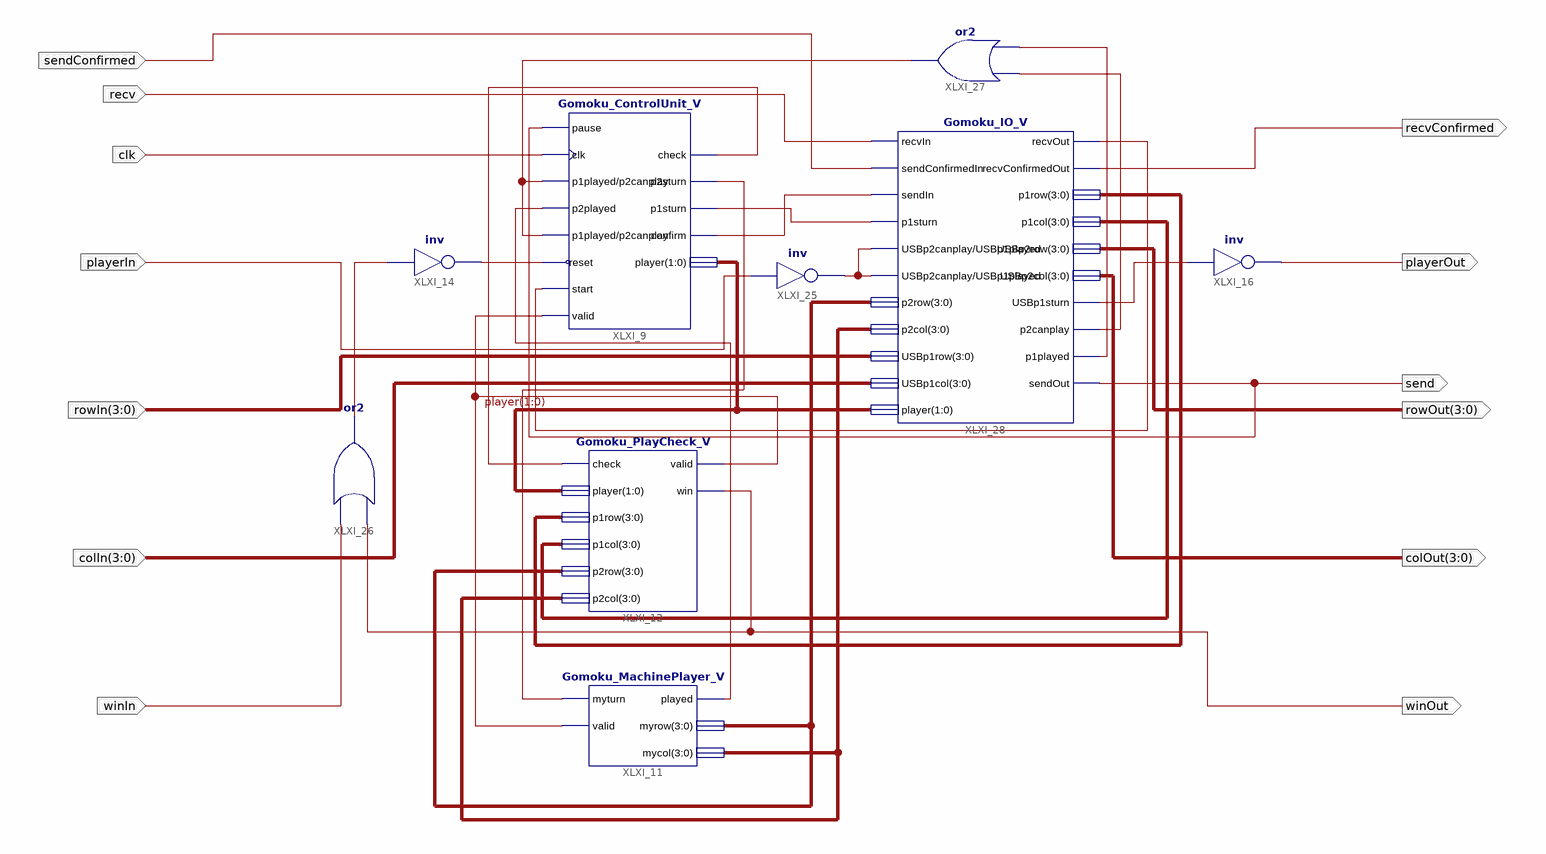
[diagram p0: schematic sheet 1]
// Xilinx ISE schematic Gomoku_Verilog.sch (artix7) as structural Verilog: 9 symbols, 13 ports
module Gomoku_Verilog (
  input  playerIn,
  input  [3:0] rowIn,
  input  [3:0] colIn,
  input  winIn,
  input  clk,
  input  recv,
  input  sendConfirmed,
  output playerOut,
  output [3:0] rowOut,
  output [3:0] colOut,
  output winOut,
  output send,
  output recvConfirmed
);

  wire XLXN_3, XLXN_5, XLXN_8, XLXN_9, XLXN_10, XLXN_13, XLXN_34, XLXN_38, XLXN_46, XLXN_47, XLXN_48,
       XLXN_52, XLXN_53, XLXN_54;
  wire [1:0] player;
  wire [3:0] XLXN_18, XLXN_19, XLXN_35, XLXN_36;

  Gomoku_ControlUnit_V XLXI_9 (
    .clk(clk), .p1played(XLXN_48), .p2played(XLXN_3), .p2canplay(XLXN_48), .reset(XLXN_10), .start(XLXN_54),
    .valid(XLXN_8), .check(XLXN_13), .p2sturn(XLXN_5), .p1sturn(XLXN_52), .confirm(XLXN_53), .player(player),
    .pause(send));
  Gomoku_MachinePlayer_V XLXI_11 (.myturn(XLXN_5), .valid(XLXN_8), .played(XLXN_3), .myrow(XLXN_18), .mycol(XLXN_19));
  Gomoku_PlayCheck_V XLXI_12 (
    .check(XLXN_13), .player(player), .p1row(XLXN_35), .p1col(XLXN_36), .p2row(XLXN_18), .p2col(XLXN_19),
    .valid(XLXN_8), .win(winOut));
  not XLXI_14 (XLXN_10, XLXN_9);
  not XLXI_16 (playerOut, XLXN_34);
  not XLXI_25 (XLXN_38, playerIn);
  or XLXI_26 (XLXN_9, winOut, winIn);
  or XLXI_27 (XLXN_48, XLXN_47, XLXN_46);
  Gomoku_IO_V XLXI_28 (
    .USBp2canplay(XLXN_38), .USBp1played(XLXN_38), .p2row(XLXN_18), .p2col(XLXN_19), .USBp1row(rowIn),
    .USBp1col(colIn), .player(player), .p1row(XLXN_35), .p1col(XLXN_36), .USBp2row(rowOut),
    .USBp2col(colOut), .USBp1sturn(XLXN_34), .p2canplay(XLXN_46), .p1played(XLXN_47), .sendOut(send),
    .sendConfirmedIn(sendConfirmed), .recvConfirmedOut(recvConfirmed), .p1sturn(XLXN_52), .sendIn(XLXN_53),
    .recvIn(recv), .recvOut(XLXN_54));
endmodule
